# Altium schematic sheet ATMega32U4.SchDoc
size A4; SheetNumber: 2; SheetTotal: 4
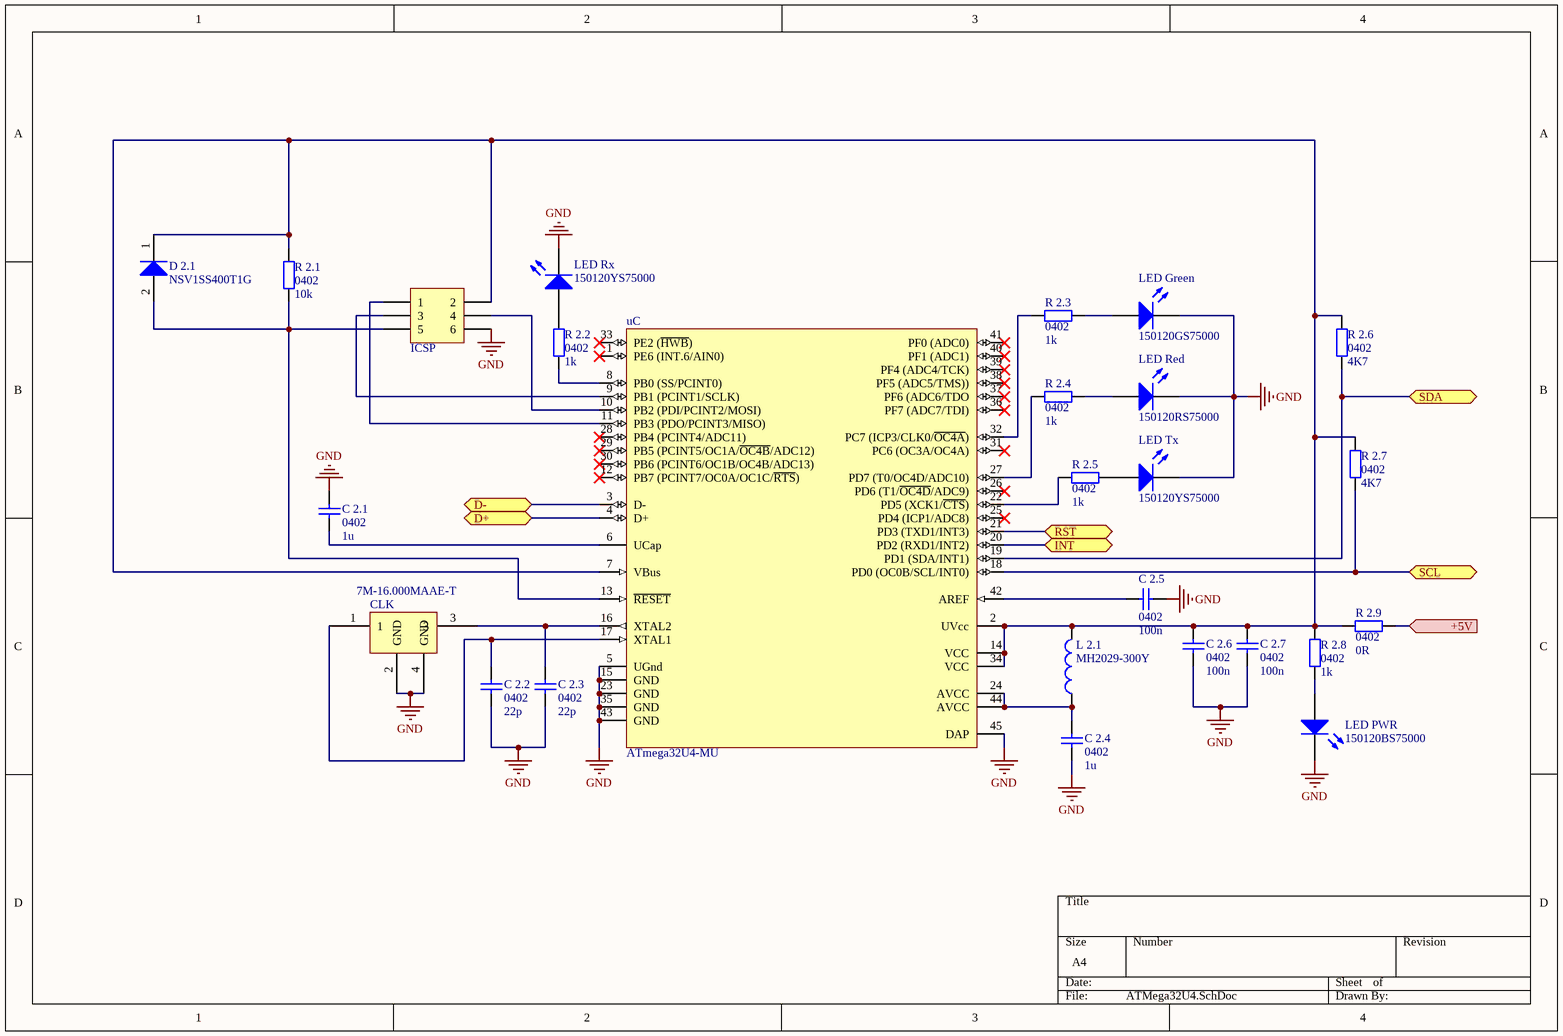
[diagram p0: ATMega32U4.SchDoc]

## Parts
C_2.1  0402  value 1u  [C0402_M]
C_2.2  0402  value 22p  [C0402_M]
C_2.3  0402  value 22p  [C0402_M]
C_2.4  0402  value 1u  [C0402_M]
C_2.5  0402  value 100n  [C0402_M]
C_2.6  0402  value 100n  [C0402_M]
C_2.7  0402  value 100n  [C0402_M]
CLK  7M-16.000MAAE-T  [7M-16.000MAAE-T]
D_2.1  NSV1SS400T1G  [ONSC-SOD-523-2-502-01_V]
ICSP  Pin Header  [PH2,54mm-3x2]  (value not drawn)
L_2.1  MH2029-300Y  [L0805_M]
LED_Green  150120GS75000  [1206_A]
LED_PWR  150120BS75000  [1206_A]
LED_Red  150120RS75000  [1206_A]
LED_Rx  150120YS75000  [1206_A]
LED_Tx  150120YS75000  [1206_A]
R_2.1  0402  value 10k  [R0402_M]
R_2.2  0402  value 1k  [R0402_M]
R_2.3  0402  value 1k  [R0402_M]
R_2.4  0402  value 1k  [R0402_M]
R_2.5  0402  value 1k  [R0402_M]
R_2.6  0402  value 4K7  [R0402_M]
R_2.7  0402  value 4K7  [R0402_M]
R_2.8  0402  value 1k  [R0402_M]
R_2.9  0402  value 0R  [R0402_M]
uC  ATmega32U4-MU  [44PW_M]

## Ports
+5V (in), D+ (bidir), D- (bidir), INT (bidir), RST (bidir), SCL (bidir), SDA (bidir)

## Nets
GND: C_2.1.2 C_2.2.1 C_2.3.1 C_2.4.1 C_2.5.2 C_2.6.1 C_2.7.1 CLK.2(GND) CLK.4(GND) ICSP.6 LED_Green.1(K) LED_PWR.1(K) LED_Red.1(K) LED_Rx.1(K) LED_Tx.1(K) uC.5(UGnd) uC.15(GND) uC.23(GND) uC.35(GND) uC.43(GND) uC.45(DAP)
+5V: R_2.9.2 ; port +5V
D+: uC.4(D+) ; port D+
D-: uC.3(D-) ; port D-
INT: uC.20(PD2_(RXD1/INT2)) ; port INT
RST: uC.21(PD3_(TXD1/INT3)) ; port RST
SCL: R_2.7.1 uC.18(PD0_(OC0B/SCL/INT0)) ; port SCL
SDA: R_2.6.1 uC.19(PD1_(SDA/INT1)) ; port SDA
NetC_2.1_1: C_2.1.1 uC.6(UCap)
NetC_2.2_2: C_2.2.2 CLK.1 uC.17(XTAL1)
NetC_2.3_2: C_2.3.2 CLK.3 uC.16(XTAL2)
NetC_2.4_2: C_2.4.2 L_2.1.1 uC.24(AVCC) uC.44(AVCC)
NetC_2.5_1: C_2.5.1 uC.42(AREF)
NetC_2.6_2: C_2.6.2 C_2.7.2 D_2.1.1(K) ICSP.2 L_2.1.2 R_2.1.2 R_2.6.2 R_2.7.2 R_2.8.2 R_2.9.1 uC.2(UVcc) uC.7(VBus) uC.14(VCC) uC.34(VCC)
NetD_2.1_2: D_2.1.2(A) ICSP.5 R_2.1.1 uC.13(~{RESET})
NetICSP_1: ICSP.1 uC.11(PB3_(PDO/PCINT3/MISO))
NetICSP_3: ICSP.3 uC.9(PB1_(PCINT1/SCLK))
NetICSP_4: ICSP.4 uC.10(PB2_(PDI/PCINT2/MOSI))
NetLED_Green_2: LED_Green.2(A) R_2.3.1
NetLED_PWR_2: LED_PWR.2(A) R_2.8.1
NetLED_Red_2: LED_Red.2(A) R_2.4.1
NetLED_Rx_2: LED_Rx.2(A) R_2.2.2
NetLED_Tx_2: LED_Tx.2(A) R_2.5.1
NetR_2.2_1: R_2.2.1 uC.8(PB0_(SS/PCINT0))
NetR_2.3_2: R_2.3.2 uC.32(PC7_(ICP3/CLK0/~{OC4A}))
NetR_2.4_2: R_2.4.2 uC.27(PD7_(T0/OC4D/ADC10))
NetR_2.5_2: R_2.5.2 uC.22(PD5_(XCK1/~{CTS}))

Not connected (* = marked no-connect by the designer): uC 1(PE6_(INT.6/AIN0))* 12(PB7_(PCINT7/OC0A/OC1C/~{RTS}))* 25(PD4_(ICP1/ADC8))* 26(PD6_(T1/~{OC4D}/ADC9))* 28(PB4_(PCINT4/ADC11))* 29(PB5_(PCINT5/OC1A/~{OC4B}/ADC12))* 30(PB6_(PCINT6/OC1B/OC4B/ADC13))* 31(PC6_(OC3A/OC4A))* 33(PE2_(~{HWB}))* 36(PF7_(ADC7/TDI))* 37(PF6_(ADC6/TDO)* 38(PF5_(ADC5/TMS)))* 39(PF4_(ADC4/TCK))* 40(PF1_(ADC1))* 41(PF0_(ADC0))*

## Library data of the parts
C_2.1 C_2.4 = C0402_X5R_1u_10V_WE: Capacitor; Manufactor: WURTH ELEKTRONIK; ManufactorPartNumber: 885012105012; Tech: X5R; VoltageRating: 10V; TempRating: -55°C to +125°C; Tolerance: ±20%; Part Number: C0402_X5R_1u_10V_WE; Type: Capacitor; Supplier 1: Digi-Key; Supplier Part Number 1: 732-7489-1-ND
C_2.2 C_2.3 = C0402_NP0_22p_50V_WE: Capacitor; Manufactor: WURTH ELEKTRONIK; ManufactorPartNumber: 885012005057; Tech: NP0; VoltageRating: 50V; TempRating: -55°C to +125°C; Tolerance: ±5%; Part Number: C0402_NP0_22p_50V_WE; Type: Capacitor; Supplier 1: Digi-Key; Supplier Part Number 1: 732-7471-1-ND
C_2.5-C_2.7 = C0402_X7R_100n_10%: Capacitor; Manufactor: Yageo; ManufactorPartNumber: CC0402KRX7R7BB104; Tech: MLCC X7R; VoltageRating: 16V; TempRating: -55°C to +125°C; Tolerance: 10%; Part Number: C0402_X7R_100n_10%; Type: Capacitor; Supplier 1: Farnell; Supplier Part Number 1: 9402047
D_2.1 = CMP-1054-00078-1: High-Speed Switching Diode, 2-Pin SOD-523, Pb-Free, Tape and Reel; Manufacturer: On Semiconductor; IF Max (A): 0.2; Configuration: Single; trr Max (ns): 4; ComponentLink3URL: http://www.onsemi.com/pub_link/Collateral/502-01.PDF; PackageDescription: 2-Pin SOD, Body 1.2 x 0.8 mm; ComponentLink1URL: http://www.onsemi.com/; Mounting Technology: Surface Mount; ComponentLink1Description: Manufacturer URL; DatasheetVersion: Rev. 7; Packing: Tape and Reel; PackageVersion: Rev. E, 09/2010; RoHS: TRUE; PartNumber: NSV1SS400T1G; PackageReference: SOD-523-2-502-01; ComponentLink3Description: Package Specification; ComponentLink2Description: Datasheet; ComponentLink2URL: http://www.onsemi.com/pub_link/Collateral/1SS400T1-D.PDF
ICSP = PH2,54mm-2x3: Part Number: PH2,54mm-2x3
L_2.1 = L0805_100n_2%: Manufactor: Coilcraft; ManufactorPartNumber: 0805CS-101XJLC; Kind: General; Value: 100n; CurrentRating: 400mA; TempRating: -40°C bis 125°C; Tolerance: 2%; Part Number: L0805_100n_2%; Supplier 1: Farnell; Supplier Part Number 1: 2286419
LED_Green = CMP-1426-00014-1: SMD mono-color Chip LED, WL-SMCW, Green; Manufacturer: Wuerth Elektronik; PackageReference: 1206_A; PartNumber: 150120GS75000; ComponentLink1Description: Manufacturer URL; ComponentLink2URL: http://katalog.we-online.com/led/datasheet/150120GS75000.pdf; ComponentLink2Description: Datasheet; Color: Green; ComponentLink1URL: http://www.we-online.com
LED_PWR = CMP-1426-00015-1: SMD mono-color Chip LED, WL-SMCW, Blue; Manufacturer: Wuerth Elektronik; ComponentLink2Description: Datasheet; ComponentLink1URL: http://www.we-online.com; PartNumber: 150120BS75000; ComponentLink1Description: Manufacturer URL; ComponentLink2URL: http://katalog.we-online.com/led/datasheet/150120BS75000.pdf; PackageReference: 1206_A; Color: Blue
LED_Red = CMP-1426-00013-1: SMD mono-color Chip LED, WL-SMCW, Red; Manufacturer: Wuerth Elektronik; Color: Red; ComponentLink2URL: http://katalog.we-online.com/led/datasheet/150120RS75000.pdf; ComponentLink2Description: Datasheet; ComponentLink1Description: Manufacturer URL; ComponentLink1URL: http://www.we-online.com; PartNumber: 150120RS75000; PackageReference: 1206_A
LED_Rx LED_Tx = CMP-1426-00019-1: SMD mono-color Chip LED, WL-SMCW, Yellow; Manufacturer: Wuerth Elektronik; ComponentLink2URL: http://katalog.we-online.com/led/datasheet/150120YS75000.pdf; PartNumber: 150120YS75000; ComponentLink1URL: http://www.we-online.com; Color: Yellow; ComponentLink1Description: Manufacturer URL; PackageReference: 1206_A; ComponentLink2Description: Datasheet
R_2.1 = R0402_1%_10k: Resistor; Manufactor: Vishay; ManufactorPartNumber: CRCW040210K0FKEDHP; Tech: Dickschicht; VoltageRating: 50V; PowerRating: 0,125W; Tolerance: 1%; Part Number: R0402_1%_10k; Type: Resistor; Supplier 1: Digi-Key; Supplier Part Number 1: 541-10.0KYCT-ND; Supplier 2: Farnell; Supplier Part Number 2: 1738864
R_2.2-R_2.5 R_2.8 = R0402_1%_1k: Resistor; Manufactor: Vishay; ManufactorPartNumber: CRCW04021K00FKED; Tech: Dickschicht; VoltageRating: 50V; PowerRating: 0,063W; Tolerance: 1%; Part Number: R0402_1%_1k; Type: Resistor; Supplier 1: Digi-Key; Supplier Part Number 1: 541-1.00KLCT-ND; Supplier 2: Farnell; Supplier Part Number 2: 1469662
R_2.6 R_2.7 = R0402_1%_3k3: Resistor; Manufactor: Yageo; ManufactorPartNumber: RC0402FR-073K3L; Tech: Dickschicht; VoltageRating: 50V; PowerRating: 0,0625W; Tolerance: 1%; Part Number: R0402_1%_3k3; Type: Resistor
R_2.9 = R0402_1%_0R: Resistor; Manufactor: Multicomp; ManufactorPartNumber: MC00625W040210R; Tech: Dickschicht; VoltageRating: 50V; PowerRating: 0,0625W; Tolerance: 1%; Part Number: R0402_1%_0R; Type: Resistor; Supplier 1: Farnell; Supplier Part Number 1: 1357983
uC = CMP-0095-00166-2: 8-bit AVR Microcontroller, 2.7-5.5V, 16MHz, 32KB Flash, 1KB EEPROM, 2.5KB SRAM, USB Controller, 44-pin QFN, Industrial Grade (-40°C to 85°C), Ext Osc; PackageVersion: revG, Sep-2009; PackageReference: 44PW; ComponentLink1URL: http://www.atmel.com/; PackageDescription: 44-Pin Quad Flat No-Lead Package, 7 x 7 mm Body, 0.5 mm Pitch (QFN); ComponentLink3Description: ATmega16U4 ATmega32U4 Summary; RevisionNote: DatasheetVersion, PackageVersion & PCB updated. URLs added.; ComponentLink2Description: ATmega16U4/32U4 Datasheet; ComponentLink1Description: Manufacturer URL; ComponentLink3URL: http://www.atmel.com/dyn/resources/prod_documents/7766S.pdf; DatasheetVersion: revF, Nov-2010; ComponentLink2URL: http://www.atmel.com/dyn/resources/prod_documents/doc7766.pdf; Code_JEDEC: MO-220-VKKD-1